# Altium schematic sheet AudioDSP-v3.1.1_top.SchDoc
size A3; SheetNumber: 1; SheetTotal: 15
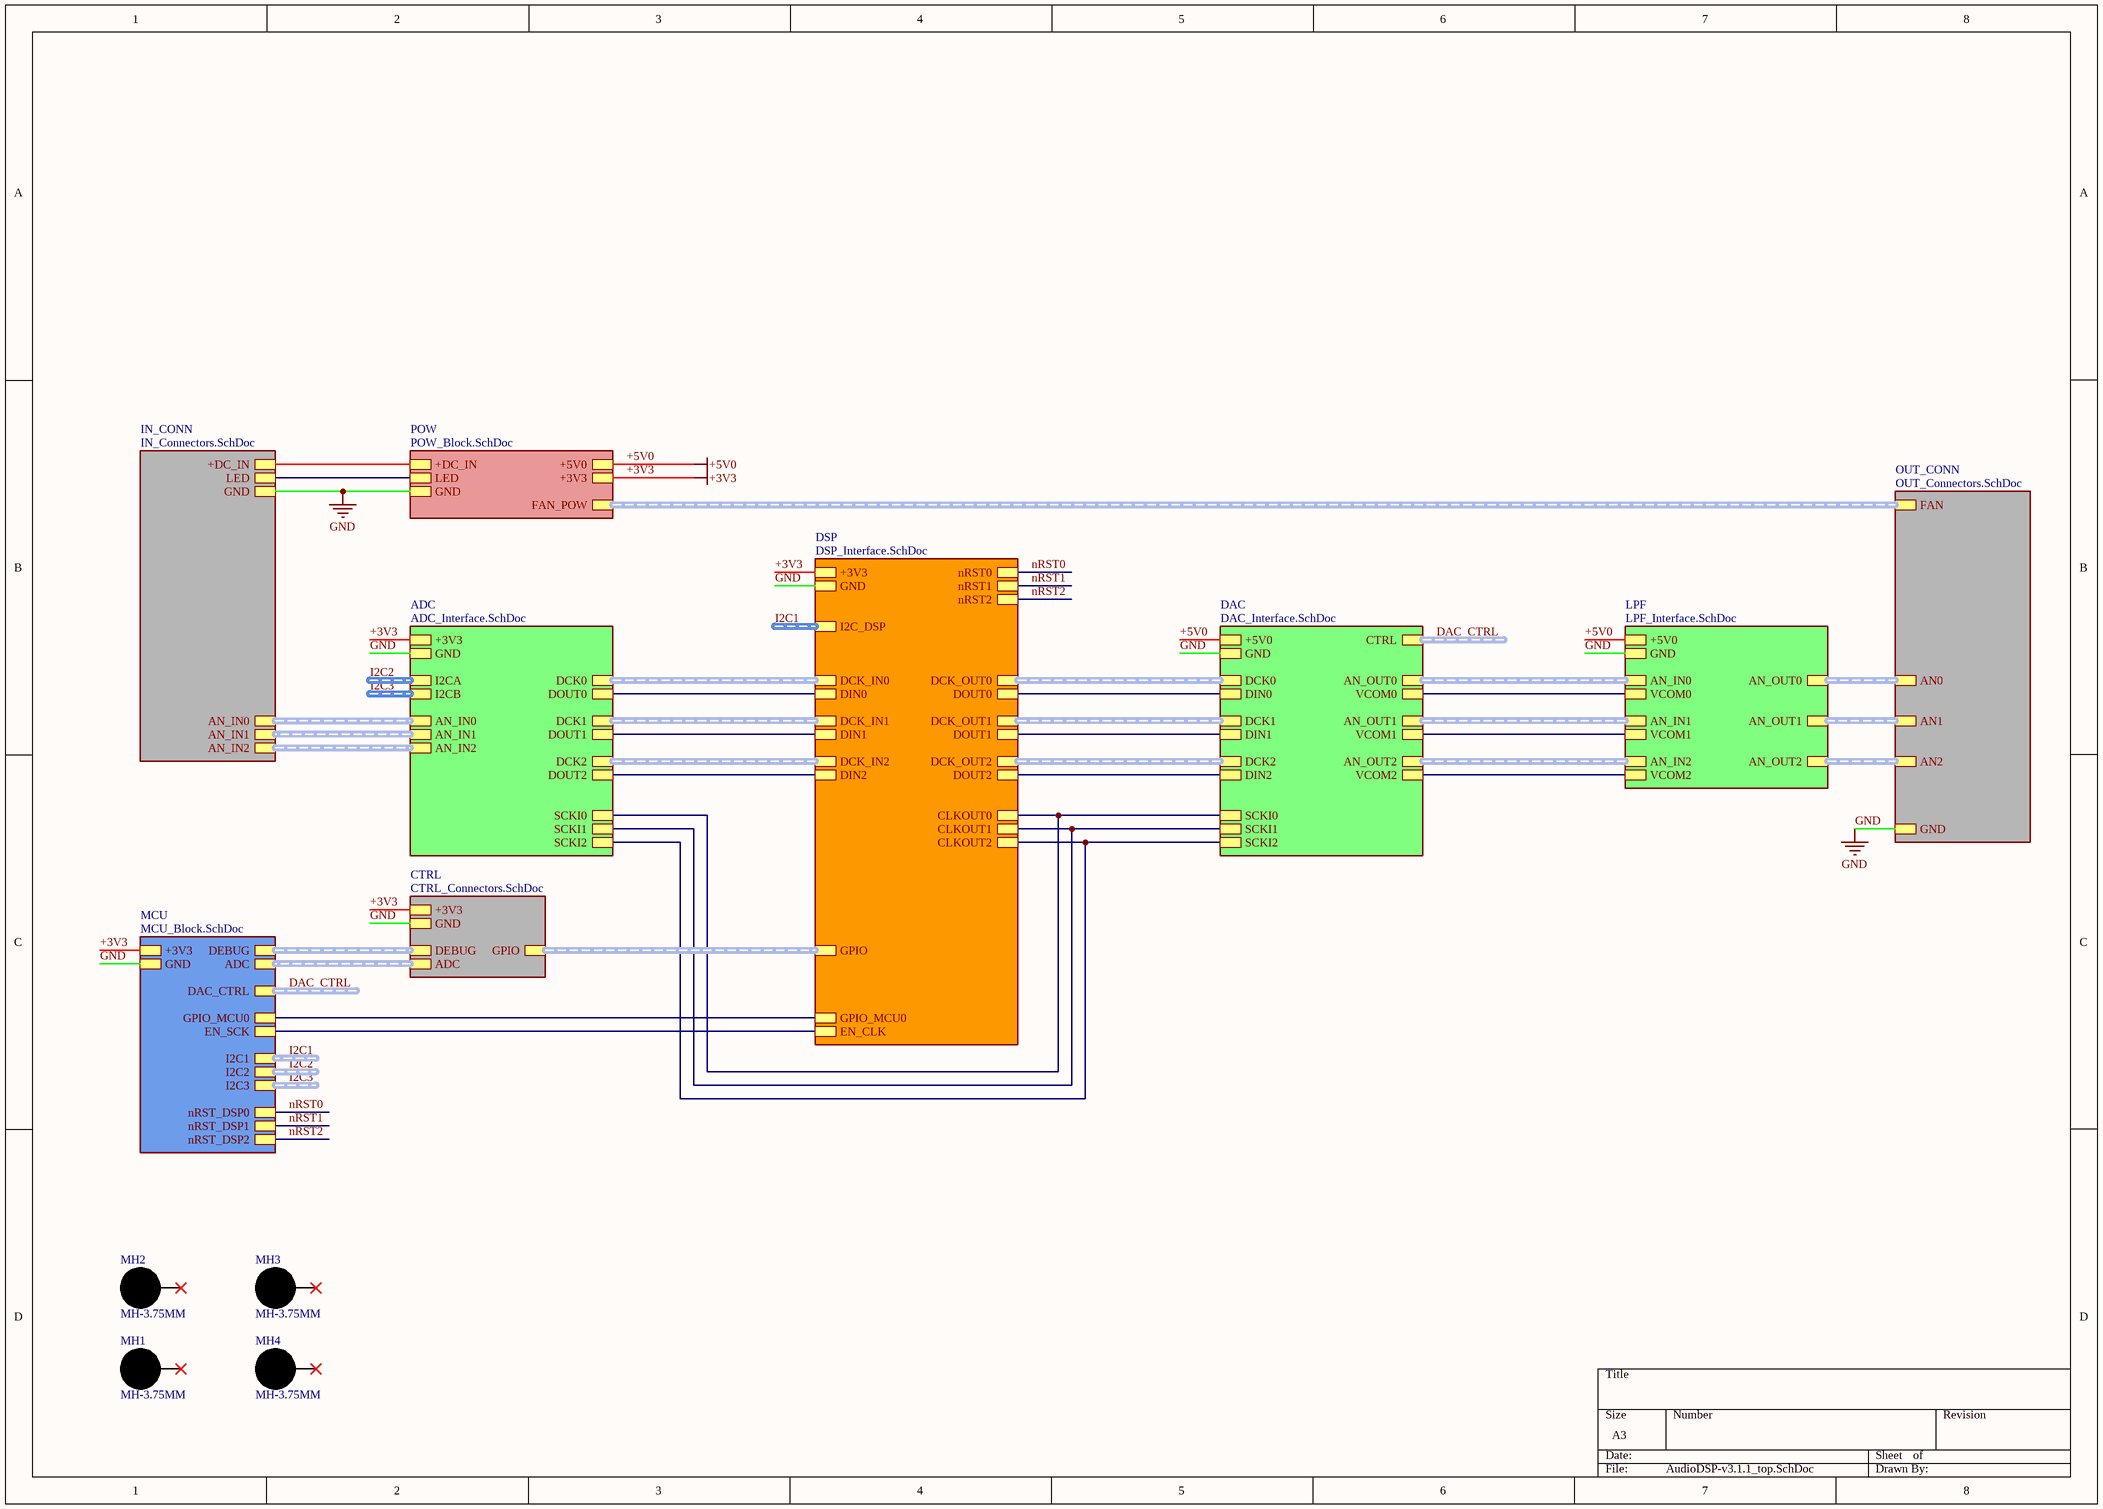
[diagram p0: AudioDSP-v3.1.1_top.SchDoc]

## Parts
MH1  MH-3.75MM  [MH-3.75mm-NP]  (no BOM)
MH2  MH-3.75MM  [MH-3.75mm-NP]  (no BOM)
MH3  MH-3.75MM  [MH-3.75mm-NP - SMALL]  (no BOM)
MH4  MH-3.75MM  [MH-3.75mm-NP]  (no BOM)

## Sub-sheets
ADC = ADC_Interface.SchDoc: +3V3, GND, I2CA (harness I2C), AN_IN0 (harness AN), SCKI0, I2CB (harness I2C), AN_IN1 (harness AN), AN_IN2 (harness AN), SCKI1, SCKI2, DCK0 (harness DCK), DOUT0, DCK1 (harness DCK), DOUT1, DCK2 (harness DCK), DOUT2
CTRL = CTRL_Connectors.SchDoc: DEBUG (harness SW), +3V3, GND, ADC (harness ADC), GPIO (harness GPIO)
DAC = DAC_Interface.SchDoc: +5V0, GND, SCKI0, SCKI1, SCKI2, DCK0 (harness DCK), DIN0, DCK1 (harness DCK), DIN1, DCK2 (harness DCK), DIN2, AN_OUT0 (harness AN), VCOM0, AN_OUT1 (harness AN), VCOM1, AN_OUT2 (harness AN), VCOM2, CTRL (harness DAC_CTRL)
DSP = DSP_Interface.SchDoc: +3V3, GND, I2C_DSP (harness I2C), nRST0, nRST1, nRST2, DCK_IN0 (harness DCK), DIN0, DCK_IN1 (harness DCK), DIN1, DCK_IN2 (harness DCK), DIN2, GPIO_MCU0, GPIO (harness GPIO), CLKOUT0, CLKOUT1, CLKOUT2, DCK_OUT0 (harness DCK), DOUT0, DCK_OUT1 (harness DCK), DOUT1, DCK_OUT2 (harness DCK), DOUT2, EN_CLK
IN_CONN = IN_Connectors.SchDoc: +DC_IN, GND, AN_IN0 (harness AN), LED, AN_IN1 (harness AN), AN_IN2 (harness AN)
LPF = LPF_Interface.SchDoc: +5V0, GND, AN_IN0 (harness AN), VCOM0, AN_IN1 (harness AN), VCOM1, AN_IN2 (harness AN), VCOM2, AN_OUT0 (harness AN), AN_OUT1 (harness AN), AN_OUT2 (harness AN)
MCU = MCU_Block.SchDoc: +3V3, GND, DEBUG (harness SW), ADC (harness ADC), I2C1 (harness I2C), I2C2 (harness I2C), I2C3 (harness I2C), nRST_DSP0, GPIO_MCU0, nRST_DSP1, nRST_DSP2, DAC_CTRL (harness DAC_CTRL), EN_SCK
OUT_CONN = OUT_Connectors.SchDoc: AN0 (harness AN), GND, AN1 (harness AN), AN2 (harness AN), FAN (harness FAN)
POW = POW_Block.SchDoc: +DC_IN, GND, +5V0, +3V3, LED, FAN_POW (harness FAN)

## Nets
+3V3: sheet CTRL/+3V3, sheet MCU/+3V3, sheet DSP/+3V3, sheet ADC/+3V3, sheet POW/+3V3
+5V0: sheet DAC/+5V0, sheet LPF/+5V0, sheet POW/+5V0
GND: sheet CTRL/GND, sheet MCU/GND, sheet DSP/GND, sheet DAC/GND, sheet IN_CONN/GND, sheet ADC/GND, sheet LPF/GND, sheet OUT_CONN/GND, sheet POW/GND
nRST0: sheet MCU/nRST_DSP0, sheet DSP/nRST0
nRST1: sheet MCU/nRST_DSP1, sheet DSP/nRST1
nRST2: sheet MCU/nRST_DSP2, sheet DSP/nRST2
(unnamed): sheet MCU/GPIO_MCU0, sheet DSP/GPIO_MCU0
(unnamed): sheet MCU/EN_SCK, sheet DSP/EN_CLK
(unnamed): sheet DSP/DIN0, sheet ADC/DOUT0
(unnamed): sheet DSP/DIN1, sheet ADC/DOUT1
(unnamed): sheet DSP/DIN2, sheet ADC/DOUT2
(unnamed): sheet DSP/CLKOUT0, sheet DAC/SCKI0, sheet ADC/SCKI0
(unnamed): sheet DSP/CLKOUT1, sheet DAC/SCKI1, sheet ADC/SCKI1
(unnamed): sheet DSP/CLKOUT2, sheet DAC/SCKI2, sheet ADC/SCKI2
(unnamed): sheet DSP/DOUT0, sheet DAC/DIN0
(unnamed): sheet DSP/DOUT1, sheet DAC/DIN1
(unnamed): sheet DSP/DOUT2, sheet DAC/DIN2
(unnamed): sheet DAC/VCOM0, sheet LPF/VCOM0
(unnamed): sheet DAC/VCOM1, sheet LPF/VCOM1
(unnamed): sheet DAC/VCOM2, sheet LPF/VCOM2
(unnamed): sheet IN_CONN/+DC_IN, sheet POW/+DC_IN
(unnamed): sheet IN_CONN/LED, sheet POW/LED

Not connected (* = marked no-connect by the designer): MH1 1*; MH2 1*; MH3 1*; MH4 1*

## Buses and harness runs
harness DAC_CTRL = sheet DAC/CTRL
harness DAC_CTRL = sheet MCU/DAC_CTRL
harness I2C1 = sheet DSP/I2C_DSP
harness I2C1 = sheet MCU/I2C1
harness I2C2 = sheet ADC/I2CA
harness I2C2 = sheet MCU/I2C2
harness I2C3 = sheet ADC/I2CB
harness I2C3 = sheet MCU/I2C3
harness sheet ADC/AN_IN0 = sheet IN_CONN/AN_IN0
harness sheet ADC/AN_IN1 = sheet IN_CONN/AN_IN1
harness sheet ADC/AN_IN2 = sheet IN_CONN/AN_IN2
harness sheet ADC/DCK0 = sheet DSP/DCK_IN0
harness sheet ADC/DCK1 = sheet DSP/DCK_IN1
harness sheet ADC/DCK2 = sheet DSP/DCK_IN2
harness sheet CTRL/ADC = sheet MCU/ADC
harness sheet CTRL/DEBUG = sheet MCU/DEBUG
harness sheet CTRL/GPIO = sheet DSP/GPIO
harness sheet DAC/AN_OUT0 = sheet LPF/AN_IN0
harness sheet DAC/AN_OUT1 = sheet LPF/AN_IN1
harness sheet DAC/AN_OUT2 = sheet LPF/AN_IN2
harness sheet DAC/DCK0 = sheet DSP/DCK_OUT0
harness sheet DAC/DCK1 = sheet DSP/DCK_OUT1
harness sheet DAC/DCK2 = sheet DSP/DCK_OUT2
harness sheet LPF/AN_OUT0 = sheet OUT_CONN/AN0
harness sheet LPF/AN_OUT1 = sheet OUT_CONN/AN1
harness sheet LPF/AN_OUT2 = sheet OUT_CONN/AN2
harness sheet OUT_CONN/FAN = sheet POW/FAN_POW

## Library data of the parts
MH1-MH4 = MH-3.75MM: ClassName: MountHole